# EasyEDA Pro project XQ8266.epro

# Schematic Schematic1
Create Date: 2023-09-23; Page Name: P1; Project Name: XQ8266; Schematic Name: Schematic1; Update Date: 2023-09-23; Company: 嘉立创EDA; Page Size: A4; Version: V1.0
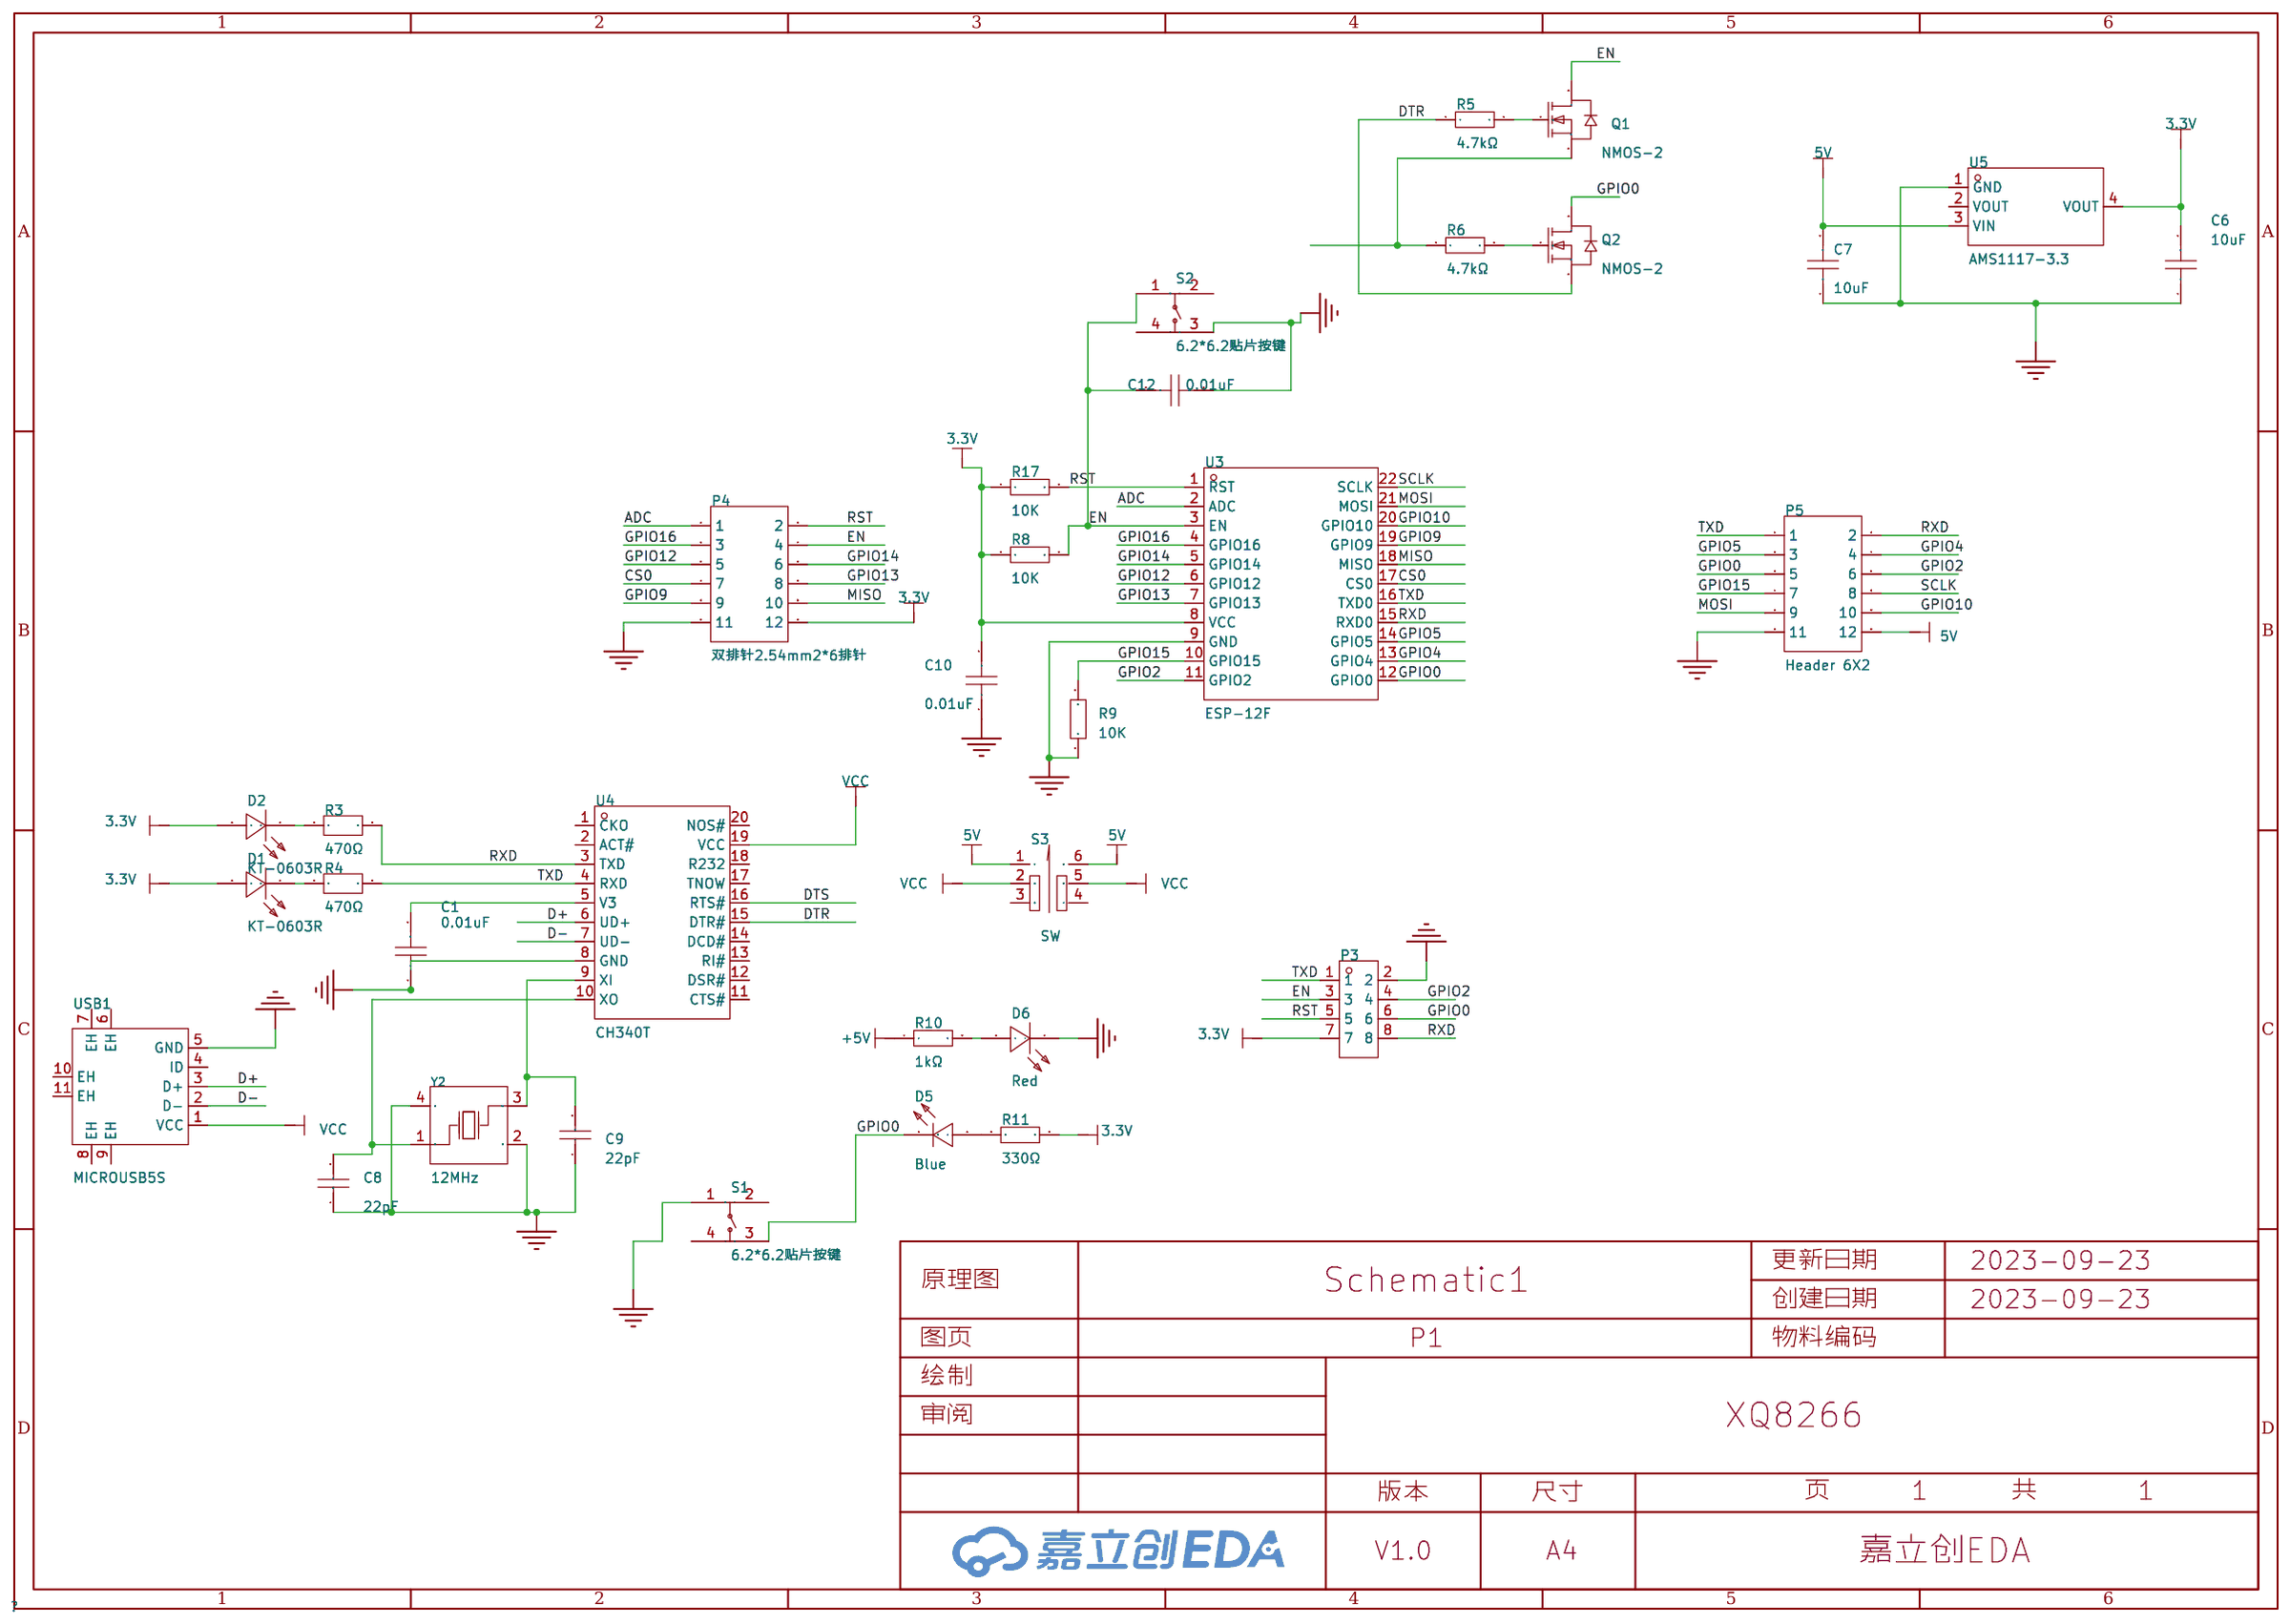
[diagram p0: schematic sheet]

## Parts
C1  0.01uF  [C0603]
C6  10uF  [C0603]
C7  10uF  [C0603]
C8  22pF  [C0603]
C9  22pF  [C0603]
C10  0.01uF  [C0603]
C12  0.01uF  [C0603]
D1  KT-0603R  [LED0603-RD]
D2  KT-0603R  [LED0603-RD]
D5  Blue  [LED0603-FD_BLUE]
D6  Red  [LED0603-RD]
P3  2.0排针 2*4p  [HDR-TH_8P-P2.54-V-M-R2-C4-S2.54_C9900007159]
P4  双排针2.54mm2*6排针  [HDR-TH_12P-P2.54-V-M-R2-C6-S2.54]
P5  Header 6X2  [HDR-TH_12P-P2.54-V-M-R2-C6-S2.54]
Q1  NMOS-2  [SOT-323-3_L2.0-W1.3-P1.30-LS2.1-BR]
Q2  NMOS-2  [SOT-323-3_L2.0-W1.3-P1.30-LS2.1-BR]
R3  470Ω  [R0603]
R4  470Ω  [R0603]
R5  4.7kΩ  [R0603]
R6  4.7kΩ  [R0603]
R8  10K  [R0603]
R9  10K  [R0603]
R10  1kΩ  [R0603]
R11  330Ω  [R0603]
R17  10K  [R0603]
S1  6.2*6.2贴片按键  [SW-SMD_4P-L6.2-W6.2-P4.00-LS9.5-TL]
S2  6.2*6.2贴片按键  [SW-SMD_4P-L6.2-W6.2-P4.00-LS9.5-TL]
S3  SW  [SW-TH_6P-L5.8-W5.8-P2.00-LS4.5-TR]
U3  ESP-12F  [WIFIM-SMD_ESP-12F-ESP8266MOD]
U4  CH340T  [SSOP-20_L7.5-W5.2-P0.65-LS8.0-BL]
U5  AMS1117-3.3  [SOT-223_L6.3-W3.5-P2.30-LS7.0-BR]
USB1  MICROUSB5S  [MICRO-USB_MICRO-USB-5S]
Y2  12MHz  [OSC-SMD_4P-L3.2-W2.5-BL]

## Library data of the parts
C1 C10 C12 = CT41-0603-2X1-50V-0.01uF-K(N): 精度:±10%;; LCSC Part Name: 10nF(103) ±10% 50V 停产; Supplier Part: C138345; Supplier Footprint: 0603; JLCPCB Part Class: 扩展库; Datasheet: https://atta.szlcsc.com/upload/public/pdf/source/20180326/C138345_833285A2150D12FF7355F029F400BCA9.pdf; Supplier: LCSC
C6 C7 = 10uF_C15415: 容值:10uF;精度:±20%;额定电压:16V;材质(温度系数):-;; LCSC Part Name: 10uF ±20% 16V; Supplier Part: C15415; Manufacturer: SAMSUNG(三星); Supplier Footprint: 0603; JLCPCB Part Class: 扩展库; Datasheet: https://atta.szlcsc.com/upload/public/pdf/source/20160103/1457707675960.pdf; Supplier: LCSC; Tolerance: ±20%; Voltage Rated: 16V
C8 C9 = CL10C220JB8NNNC: 容值:22pF;精度:±5%;额定电压:50V;材质(温度系数):C0G;; LCSC Part Name: 22pF ±5% 50V; Supplier Part: C1653; Manufacturer: SAMSUNG(三星); Supplier Footprint: 0603; JLCPCB Part Class: 基础库; Datasheet: https://atta.szlcsc.com/upload/public/pdf/source/20160103/1457707687317.pdf; Supplier: LCSC; Tolerance: ±5%; Voltage Rated: 50V; Temperature Coefficient: C0G
D1 D2 = KT-0603R: 发光颜色:红灯;二极管配置:-;透镜颜色:-;主波长:-;色温:-;功率:-;发光角度:-;安装方式:-;工作温度:-40℃~+85℃;; LCSC Part Name: 0603 红灯 高亮; Supplier Part: C2286; Manufacturer: KENTO; Supplier Footprint: 0603; JLCPCB Part Class: 基础库; Datasheet: https://atta.szlcsc.com/upload/public/pdf/source/20160616/1466072038404.pdf; Supplier: LCSC; Emitted Color: 红灯; Operating Temperature: -40℃~+85℃
D5 = 19-217/BHC-ZL1M2RY/3T: 发光颜色:蓝灯;二极管配置:-;主波长:465nm~475nm;色温:-;功率:110mW;安装方式:-;; LCSC Part Name: 蓝灯; Supplier Part: C72041; Manufacturer: EVERLIGHT(亿光); Supplier Footprint: 0603; JLCPCB Part Class: 基础库; Datasheet: https://atta.szlcsc.com/upload/public/pdf/source/20170116/1484561237273.pdf; Supplier: LCSC; Emitted Color: 蓝灯; Lens Color: 无色透明; Dominant Wavelength: 465nm~475nm; Peak Wavelength: 468nm; Forward Current: 5mA; Power Dissipation: 110mW; Viewing Angle: 120°; Operating Temperature: -40℃~+85℃
D6 = LTE-C9908-GD: Supplier Part: C9900001449; Supplier Footprint: LED0603; JLCPCB Part Class: 扩展库; Datasheet: 2021-11-05/656770A/3885ef6749d04b31ac892d11046affd6/LTE-C9908-GD.pdf; Supplier: LCSC
P3 = 2.0排针 2*4p: Supplier Part: C9900022073; Supplier Footprint: 2.0-2*4P; JLCPCB Part Class: 扩展库; Datasheet: https://atta.szlcsc.comnull; Supplier: LCSC
P4 P5 = 双排针2.54mm2*6排针: LCSC Part Name: 双排针2*6  间距2.54mm; Supplier Part: C66689; Supplier Footprint: Through Hole; JLCPCB Part Class: 扩展库; Supplier: LCSC
Q1 Q2 = NMOS-2: Supplier Part: C9900017079; JLCPCB Part Class: 扩展库; Datasheet: https://atta.szlcsc.comnull; Supplier: LCSC
R3 R4 = CR0603F470RP05Z: 阻值:470Ω;精度:±1%;功率:100mW;; LCSC Part Name: 470Ω ±1% 100mW; Supplier Part: C881392; Manufacturer: EVER OHMS(天二科技); Supplier Footprint: 0603; JLCPCB Part Class: 扩展库; Datasheet: https://atta.szlcsc.com/upload/public/pdf/source/20201014/C881429_ABC29D63C8D6A11EB63D87348B25AA7B.pdf; Supplier: LCSC; Tolerance: ±1%; Power(Watts): 100mW; Temperature Coefficient: ±100ppm/℃
R5 R6 = 0603WAF4701T5E: 电阻类型:厚膜电阻;阻值:4.7kΩ;精度:±1%;功率:100mW;; LCSC Part Name: 4.7kΩ ±1% 100mW; Supplier Part: C23162; Manufacturer: UNI-ROYAL(厚声); Supplier Footprint: 0603; JLCPCB Part Class: 基础库; Datasheet: https://atta.szlcsc.com/upload/public/pdf/source/20200306/C422600_1E6D84923E4A46A82E41ADD87F860B5C.pdf; Supplier: LCSC; Type: 厚膜电阻; Tolerance: ±1%; Power(Watts): 100mW; Temperature Coefficient: ±100ppm/℃; Overload Voltage (Max): 75V; Operating Temperature Range: -55℃~+155℃
R8 R9 R17 = 0603WAF1002T5E: 电阻类型:厚膜电阻;阻值:10kΩ;精度:±1%;功率:100mW;; LCSC Part Name: 厚膜电阻 10kΩ ±1% 100mW; Supplier Part: C25804; Manufacturer: UNI-ROYAL(厚声); Supplier Footprint: 0603; JLCPCB Part Class: 基础库; Datasheet: https://atta.szlcsc.com/upload/public/pdf/source/20200306/C422600_1E6D84923E4A46A82E41ADD87F860B5C.pdf; Supplier: LCSC; Type: 厚膜电阻; Tolerance: ±1%; Power(Watts): 100mW; Temperature Coefficient: ±100ppm/℃; Overload Voltage (Max): 75V; Operating Temperature Range: -55℃~+155℃
R10 = 0603WAF1001T5E: 电阻类型:厚膜电阻;阻值:1kΩ;精度:±1%;功率:100mW;; LCSC Part Name: 1kΩ ±1% 100mW; Supplier Part: C21190; Manufacturer: UNI-ROYAL(厚声); Supplier Footprint: 0603; JLCPCB Part Class: 基础库; Datasheet: https://atta.szlcsc.com/upload/public/pdf/source/20200306/C422600_1E6D84923E4A46A82E41ADD87F860B5C.pdf; Supplier: LCSC; Type: 厚膜电阻; Tolerance: ±1%; Power(Watts): 100mW; Temperature Coefficient: ±100ppm/℃; Overload Voltage (Max): 75V; Operating Temperature Range: -55℃~+155℃
R11 = 0805W8F3300T5E: 电阻类型:厚膜电阻;阻值:330Ω;精度:±1%;功率:125mW;; LCSC Part Name: 330Ω ±1% 125mW; Supplier Part: C17630; Manufacturer: UNI-ROYAL(厚声); Supplier Footprint: 0805; JLCPCB Part Class: 基础库; Datasheet: https://atta.szlcsc.com/upload/public/pdf/source/20200306/C422600_1E6D84923E4A46A82E41ADD87F860B5C.pdf; Supplier: LCSC; Type: 厚膜电阻; Tolerance: ±1%; Power(Watts): 125mW; Temperature Coefficient: ±100ppm/℃; Overload Voltage (Max): 150V; Operating Temperature Range: -55℃~+155℃
S1 S2 = 6.2*6.2贴片按键: Supplier Part: C9900016276; Supplier Footprint: Button_Switch_SMD:SW_Push_1P1T_NO_6x6mm_H9.5mm; JLCPCB Part Class: 扩展库; Datasheet: https://atta.szlcsc.comnull; Supplier: LCSC
S3 = 自锁开关 5.8Z白灰白260G: 耐温260度; LCSC Part Name: 自锁开关 5.8Z白灰白 260G  5.8*5.8mm; Supplier Part: C56857; Supplier Footprint: Through Hole; JLCPCB Part Class: 扩展库; Datasheet: https://atta.szlcsc.com/upload/public/pdf/source/20160318/1458266987096.pdf; Supplier: LCSC
U3 = ESP-12F(ESP8266MOD): 频率:2.4GHz;发射功率:16dBm;核心处理器:ESP8266;天线形式:PCB 板载天线;接收灵敏度:-90dBm;; LCSC Part Name: 完整的802.11b/g/n Wi-Fi的SoC模块; Supplier Part: C82891; Manufacturer: Ai-Thinker(安信可); Supplier Footprint: SMD,16x24mm; JLCPCB Part Class: 扩展库; Datasheet: https://atta.szlcsc.com/upload/public/pdf/source/20210219/C82891_ABD84A460F4F056A2757267CCCA4B508.pdf; Supplier: LCSC; Output Power: 16dBm; Core Processor: ESP8266; Support Interface: GPIO；UART；I2C；PWM；SPI；ADC; Antenna Type: PCB 板载天线; Wireless Standard: 802.11b/g/n; Operating Voltage: 3.3V; Receive  Current: 120mA; Send  Current: 170mA; Sensitivity: -90dBm; Operating Temperature: -40℃~+85℃
U4 = CH340T: 应用功能:收发器;接口协议:USB 2.0;数据速率:2Mbps;供电电压:3.3V；5V;; Supplier Part: C8689; Manufacturer: WCH(南京沁恒); Supplier Footprint: SSOP-20-208mil; JLCPCB Part Class: 扩展库; Datasheet: https://atta.szlcsc.com/upload/public/pdf/source/20200819/C8689_75D6473E5CD694BFB8B94C7CCD8C6758.pdf; Supplier: LCSC; Applications Function: 收发器; Protocol: USB 2.0; Data Rate: 2Mbps; Supply Voltage: 3.3V；5V
U5 = AMS1117-3.3_C6186: 输出类型:固定;输出极性:正;最大输入电压:-;输出电压:3.3V;输出电流:1A;电源纹波抑制比(PSRR):72dB@(120Hz);; LCSC Part Name: 输出3.3V 1A; Supplier Part: C6186; Manufacturer: AMS; Supplier Footprint: SOT-223; JLCPCB Part Class: 基础库; Datasheet: https://atta.szlcsc.com/upload/public/pdf/source/20180727/C6186_7A095716F0823C02F1997A905E26C086.pdf; Supplier: LCSC; Output Type: 固定; Output Polarity: 正; Number of Outputs: 1; Output Voltage: 3.3V; Dropout Voltage: 1.3V@(800mA); Output Current: 1A; Power Supply Rejection Ratio (PSRR): 72dB@(120Hz)
USB1 = MICROUSB5S: Supplier Part: C9900018063; Supplier Footprint: MICROUSB; JLCPCB Part Class: 扩展库; Datasheet: https://atta.szlcsc.comnull; Supplier: LCSC
Y2 = X322512MSB4SI: 频率:12MHz;频率公差:±10ppm;负载电容:20pF;; LCSC Part Name: 12MHz ±10ppm 20pF YSX321SL; Supplier Part: C9002; Manufacturer: YXC(扬兴晶振); Supplier Footprint: SMD3225-4P; JLCPCB Part Class: 基础库; Datasheet: https://atta.szlcsc.com/upload/public/pdf/source/20210329/C112971_1F611BDC486E193C1706F6D8EB5AA189.pdf; Supplier: LCSC; Crystal Type: 贴片无源晶振; Frequency Tolerance: ±10ppm; Frequency Stability: ±30ppm; Load Capacitance: 20pF; Operating Temperature: -40℃~+85℃

## Nets
3.3V: C6.2 C10.2 D1.2(A) D2.2(A) P3.7 P4.12 R8.1 R11.2 R17.1 U3.8(VCC) U5.4(VOUT)
5V: C7.2 P5.12 S3.1 S3.6 U5.3(VIN)
+5V: R10.1
GND: C1.1 C6.1 C7.1 C8.1 C9.1 C10.1 C12.1 D6.1(-) P3.2 P4.11 P5.11 R9.1 S1.1 S2.3 U3.9(GND) U4.8(GND) U5.1(GND) USB1.5(GND) Y2.2(GND) Y2.4(GND)
VCC: S3.2 S3.5 U4.19(VCC) USB1.1(VCC)
ADC: P4.1 U3.2(ADC)
CS0: P4.7 U3.17(CS0)
D+: U4.6(UD+) USB1.3(D+)
D-: U4.7(UD-) USB1.2(D-)
DTR: Q2.2(S) R5.1 U4.15(DTR#)
DTS: U4.16(RTS#)
EN: C12.2 P3.3 P4.4 Q1.3(D) R8.2 S2.1 U3.3(EN)
GPIO0: D5.1(C) P3.6 P5.5 Q2.3(D) S1.3 U3.12(GPIO0)
GPIO2: P3.4 P5.6 U3.11(GPIO2)
GPIO4: P5.4 U3.13(GPIO4)
GPIO5: P5.3 U3.14(GPIO5)
GPIO9: P4.9 U3.19(GPIO9)
GPIO10: P5.10 U3.20(GPIO10)
GPIO12: P4.5 U3.6(GPIO12)
GPIO13: P4.8 U3.7(GPIO13)
GPIO14: P4.6 U3.5(GPIO14)
GPIO15: P5.7 R9.2 U3.10(GPIO15)
GPIO16: P4.3 U3.4(GPIO16)
MISO: P4.10 U3.18(MISO)
MOSI: P5.9 U3.21(MOSI)
RST: P3.5 P4.2 R17.2 U3.1(RST)
RXD: P3.8 P5.2 R3.2 U3.15(RXD0) U4.3(TXD)
SCLK: P5.8 U3.22(SCLK)
TXD: P3.1 P5.1 R4.2 U3.16(TXD0) U4.4(RXD)
$1N964: C1.2 U4.5(V3)
$1N1564: D2.1(K) R3.1
$1N1566: D1.1(K) R4.1
$1N1958: D5.2(A) R11.1
$1N3851: Q1.1(G) R5.2
$1N3854: Q2.1(G) R6.2
$1N3868: Q1.2(S) R6.1
$1N4121: D6.2(+) R10.2
$1N4396: C8.2 U4.10(XO) Y2.1(OSC1)
$1N4419: C9.2 U4.9(XI) Y2.3(OSC2)

Not connected (* = marked no-connect by the designer): S1 2 4; S2 2 4; S3 3 4; U4 1(CKO) 2(ACT#) 11(CTS#) 12(DSR#) 13(RI#) 14(DCD#) 17(TNOW) 18(R232) 20(NOS#); U5 2(VOUT); USB1 4(ID) 6(EH) 7(EH) 8(EH) 9(EH) 10(EH) 11(EH)

# Board PCB1
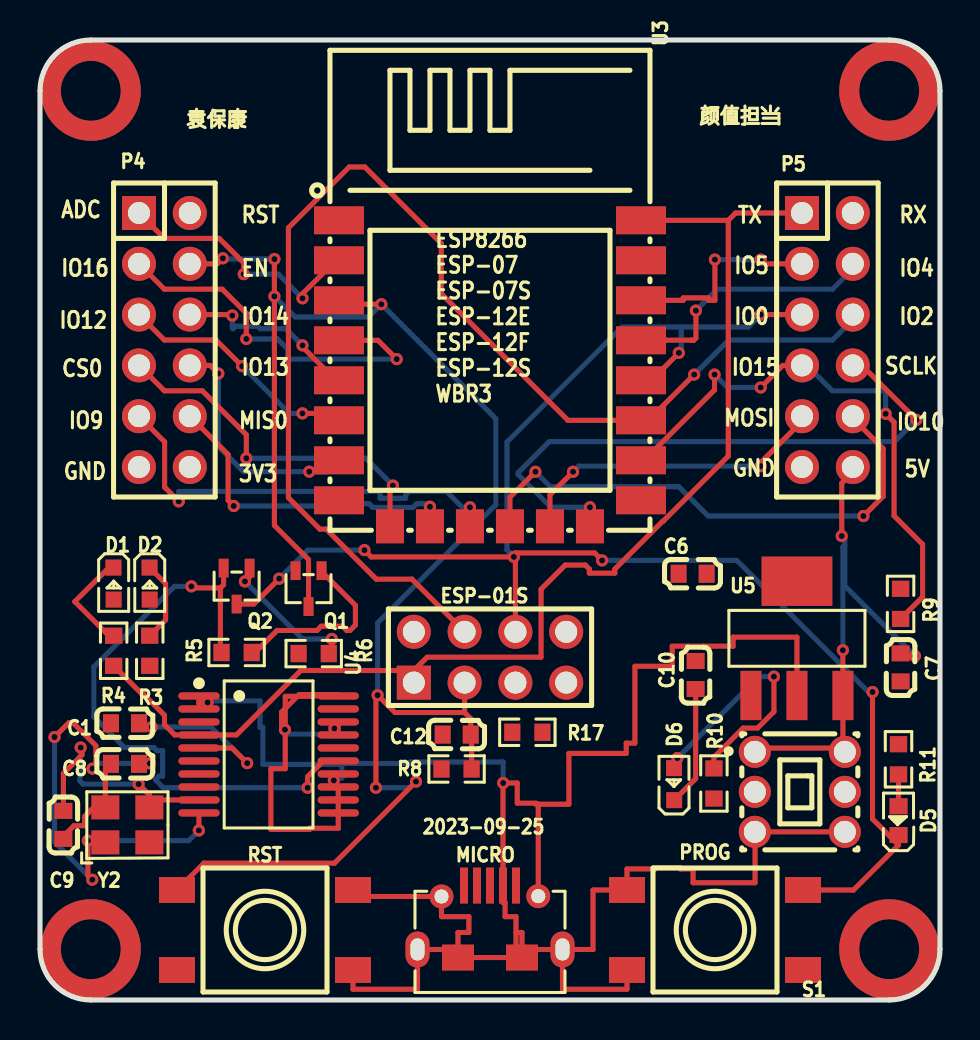
[diagram p1: board, top side]
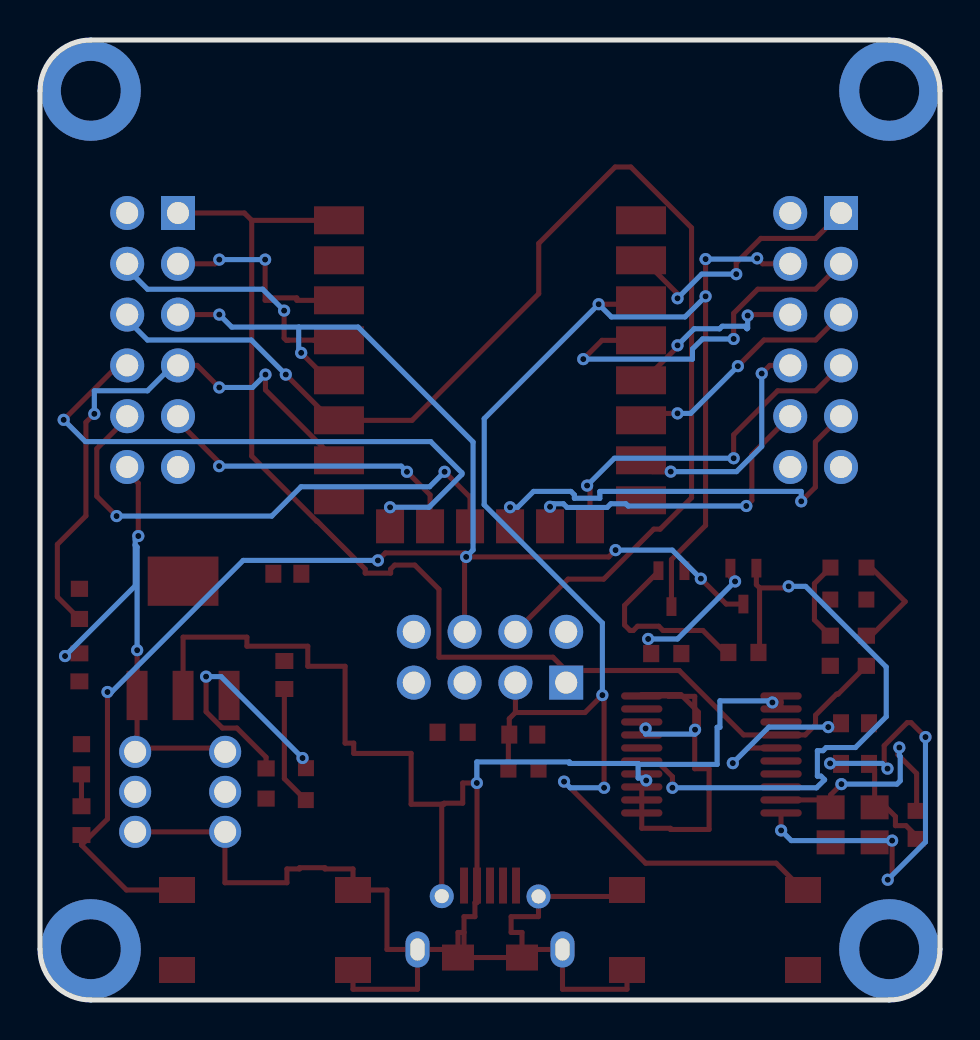
[diagram p2: board, bottom side, seen from below]

Outline 45 x 48 mm; copper layers: Top Layer, Bottom Layer. Coordinates in mm from the lower left corner of the outline.
Outline path: 0,45.46 0,2.54 arc(0.74,0.74) 2.54,0 42.46,0 arc(44.26,0.74) 45,2.54 45,45.46 arc(44.26,47.26) 42.46,48 2.54,48 arc(0.74,47.26) 0,45.46
Stack: Top Layer 0.035mm / Dielectric1 1.51mm FR4 er 4.5 / Bottom Layer 0.035mm

## Design rules (mm)
template: JLCPCB Capability(Two Layers Board)
spacing copperThickness1oz (default): track to track 0.102, other pairs 0.152 to 0.3
spacing copperThickness2oz: track to track 0.203, other pairs 0.152 to 0.3
track width copperThickness1oz (default): min 0.127, default 0.254, max 2.54
track width copperThickness2oz: min 0.203, default 0.254, max 2.54
differential pair differentialPair (default): width min 0.127, default 0.254, max 2.54; gap min 0.152, default 0.152
via viaSize (default): diameter min 0.5, default 0.61, max 10; hole min 0.3, default 0.305, max 6.3

## Placement (name value [footprint] x y rotation side)
C1  0.01uF  [C0603]  4.25 13.84 0 top
C6  10uF  [C0603]  32.63 21.31 0 top
C7  10uF  [C0603]  43.03 16.63 90 top
C8  22pF  [C0603]  4.25 11.81 0 top
C9  22pF  [C0603]  1.17 8.76 90 top
C10  0.01uF  [C0603]  32.78 16.25 90 top
C12  0.01uF  [C0603]  20.84 13.27 0 top
D1  KT-0603R  [LED0603-RD]  3.68 20.82 270 top
D2  KT-0603R  [LED0603-RD]  5.48 20.82 270 top
D5  Blue  [LED0603-FD_BLUE]  42.93 8.97 90 top
D6  Red  [LED0603-RD]  31.71 10.79 90 top
ESP-01S  2.0排针 2*4p  [HDR-TH_8P-P2.54-V-M-R2-C4-S2.54_C9900007159]  22.5 17.14 0 top
MICRO  MICROUSB5S  [MICRO-USB_MICRO-USB-5S]  22.5 3.92 180 top
P4  双排针2.54mm2*6排针  [HDR-TH_12P-P2.54-V-M-R2-C6-S2.54]  6.22 33 270 top
P5  Header 6X2  [HDR-TH_12P-P2.54-V-M-R2-C6-S2.54]  39.37 33 270 top
PROG  SW  [SW-TH_6P-L5.8-W5.8-P2.00-LS4.5-TR]  37.99 10.41 90 top
Q1  NMOS-2  [SOT-323-3_L2.0-W1.3-P1.30-LS2.1-BR]  13.43 20.57 90 top
Q2  NMOS-2  [SOT-323-3_L2.0-W1.3-P1.30-LS2.1-BR]  9.83 20.69 90 top
R3  470Ω  [R0603]  5.49 17.46 270 top
R4  470Ω  [R0603]  3.68 17.46 270 top
R5  4.7kΩ  [R0603]  9.83 17.38 0 top
R6  4.7kΩ  [R0603]  13.69 17.32 0 top
R8  10K  [R0603]  20.83 11.55 0 top
R9  10K  [R0603]  43.03 19.81 270 top
R10  1kΩ  [R0603]  33.7 10.82 90 top
R11  330Ω  [R0603]  42.93 12.04 90 top
R17  10K  [R0603]  24.37 13.39 0 top
RST  6.2*6.2贴片按键  [SW-SMD_4P-L6.2-W6.2-P4.00-LS9.5-TL]  11.25 3.5 0 top
S1  6.2*6.2贴片按键  [SW-SMD_4P-L6.2-W6.2-P4.00-LS9.5-TL]  33.75 3.5 180 top
U3  ESP-12F  [WIFIM-SMD_ESP-12F-ESP8266MOD]  22.5 31.33 270 top
U4  CH340T  [SSOP-20_L7.5-W5.2-P0.65-LS8.0-BL]  11.43 12.28 270 top
U5  AMS1117-3.3  [SOT-223_L6.3-W3.5-P2.30-LS7.0-BR]  37.85 18.08 270 top
Y2  12MHz  [OSC-SMD_4P-L3.2-W2.5-BL]  4.37 8.76 0 top

## Footprints (pads in the part's own frame, mm; a bottom-side part is the same pattern mirrored in y, then rotated)
C0603
  rect 0.8x0.9 smd: 1(-0.7,0) 2(0.7,0)
HDR-TH_8P-P2.54-V-M-R2-C4-S2.54_C9900007159
  rect 1.7x1.7 hole 1.1: 1(-3.81,-1.27)
  round 1.7 hole 1.1: 2(-3.81,1.27) 3(-1.27,-1.27) 4(-1.27,1.27) 5(1.27,-1.27) 6(1.27,1.27) 7(3.81,-1.27) 8(3.81,1.27)
HDR-TH_12P-P2.54-V-M-R2-C6-S2.54
  rect 1.7x1.7 hole 1.1: 1(-6.35,-1.27)
  round 1.7 hole 1.1: 2(-6.35,1.27) 3(-3.81,-1.27) 4(-3.81,1.27) 5(-1.27,-1.27) 6(-1.27,1.27) 7(1.27,-1.27) 8(1.27,1.27) 9(3.81,-1.27) 10(3.81,1.27) 11(6.35,-1.27) 12(6.35,1.27)
LED0603-FD_BLUE
  rect 0.8x0.9 smd: 1(-0.72,0) 2(0.72,0)
LED0603-RD
  rect 0.8x0.8 smd: 1(-0.799,-0.004) 2(0.799,0.004)
MICRO-USB_MICRO-USB-5S
  rect 0.4x1.8 smd: 1(1.3,-1.8) 2(0.65,-1.8) 3(0.001,-1.8) 4(-0.649,-1.8) 5(-1.3,-1.8)
  round 1.2 hole 0.7: 6(-2.413,-1.27) 9(2.425,-1.254)
  oval 1.2x1.8 hole 0.7x1.1: 7(-3.625,1.396) 8(3.625,1.396)
  rect 1.6x1.3 smd: 10(-1.6,1.8) 11(1.6,1.8)
OSC-SMD_4P-L3.2-W2.5-BL
  rect 1.4x1.2 smd: 1(-1.1,-0.875) 2(1.1,-0.875) 3(1.1,0.875) 4(-1.1,0.875)
R0603
  rect 0.806x0.864 smd: 1(-0.753,0) 2(0.753,0)
SOT-223_L6.3-W3.5-P2.30-LS7.0-BR
  rect 2.465x1.05 smd: 1(2.857,-2.3) 2(2.857,0) 3(2.857,2.3)
  rect 2.465x3.54 smd: 4(-2.857,0)
SOT-323-3_L2.0-W1.3-P1.30-LS2.1-BR
  rect 0.936x0.5 smd: 1(0.898,-0.65) 2(0.898,0.65) 3(-0.898,0)
SSOP-20_L7.5-W5.2-P0.65-LS8.0-BL
  oval 0.364x2.069 smd: 1(-2.925,-3.482) 2(-2.275,-3.482) 3(-1.625,-3.482) 4(-0.975,-3.482) 5(-0.325,-3.482) 6(0.325,-3.482) 7(0.975,-3.482) 8(1.625,-3.482) 9(2.275,-3.482) 10(2.925,-3.482) 11(2.925,3.482) 12(2.275,3.482) 13(1.625,3.482) 14(0.975,3.482) 15(0.325,3.482) 16(-0.325,3.482) 17(-0.975,3.482) 18(-1.625,3.482) 19(-2.275,3.482) 20(-2.925,3.482)
SW-SMD_4P-L6.2-W6.2-P4.00-LS9.5-TL
  rect 1.8x1.3 smd: 1(-4.4,2) 2(4.4,2) 3(-4.4,-2) 4(4.4,-2)
SW-TH_6P-L5.8-W5.8-P2.00-LS4.5-TR
  round 1.6 hole 1.1: 1(2,2.25) 2(0,2.25) 3(-2,2.25) 4(-2,-2.25) 5(0,-2.25) 6(2,-2.25)
WIFIM-SMD_ESP-12F-ESP8266MOD
  rect 1.4x2.5 smd: 1(-7.651,-7.551) 2(-5.651,-7.551) 3(-3.651,-7.551) 4(-1.651,-7.551) 5(0.349,-7.551) 6(2.349,-7.551) 7(4.349,-7.551) 8(6.349,-7.551) 9(6.349,7.548) 10(4.349,7.55) 11(2.349,7.551) 12(0.349,7.551) 13(-1.651,7.55) 14(-3.651,7.551) 15(-5.651,7.551) 16(-7.651,7.551)
  rect 1.7x1.4 smd: 17(7.651,-5) 18(7.649,-3.002) 19(7.649,-1.004) 20(7.649,0.998) 21(7.649,2.997) 22(7.651,4.997)

## Nets
3.3V: C6.2 C10.2 D1.2 D2.2 ESP-01S.7 P4.12 R8.1 R11.2 R17.1 U3.8 U5.4
5V: C7.2 P5.12 PROG.1 PROG.6 U5.3
+5V: R10.1
GND: C1.1 C6.1 C7.1 C8.1 C9.1 C10.1 C12.1 D6.1 ESP-01S.2 MICRO.5 P4.11 P5.11 R9.1 RST.3 S1.1 U3.9 U4.8 U5.1 Y2.2 Y2.4
VCC: MICRO.1 PROG.2 PROG.5 U4.19
ADC: P4.1 U3.2
CS0: P4.7 U3.17
D+: MICRO.3 U4.6
D-: MICRO.2 U4.7
DTR: Q2.2 R5.1 U4.15
DTS: U4.16
EN: C12.2 ESP-01S.3 P4.4 Q1.3 R8.2 RST.1 U3.3
GPIO0: D5.1 ESP-01S.6 P5.5 Q2.3 S1.3 U3.12
GPIO2: ESP-01S.4 P5.6 U3.11
GPIO4: P5.4 U3.13
GPIO5: P5.3 U3.14
GPIO9: P4.9 U3.19
GPIO10: P5.10 U3.20
GPIO12: P4.5 U3.6
GPIO13: P4.8 U3.7
GPIO14: P4.6 U3.5
GPIO15: P5.7 R9.2 U3.10
GPIO16: P4.3 U3.4
MISO: P4.10 U3.18
MOSI: P5.9 U3.21
RST: ESP-01S.5 P4.2 R17.2 U3.1
RXD: ESP-01S.8 P5.2 R3.2 U3.15 U4.3
SCLK: P5.8 U3.22
TXD: ESP-01S.1 P5.1 R4.2 U3.16 U4.4
$1N964: C1.2 U4.5
$1N1564: D2.1 R3.1
$1N1566: D1.1 R4.1
$1N1958: D5.2 R11.1
$1N3851: Q1.1 R5.2
$1N3854: Q2.1 R6.2
$1N3868: Q1.2 R6.1
$1N4121: D6.2 R10.2
$1N4396: C8.2 U4.10 Y2.1
$1N4419: C9.2 U4.9 Y2.3

Pads without a net: MICRO 4 6 7 8 9 10 11; PROG 3 4; RST 2 4; S1 2 4; U4 1 2 11 12 13 14 17 18 20; U5 2

## Via types
v1: diameter 0.61, hole 0.305, Top Layer to Bottom Layer, 67 vias
v2: diameter 5, hole 3, Top Layer to Bottom Layer, 4 vias

## Routing (per net, layer and track width the routed paths; a pad name or vN(x,y) marks a point on that pad's centre or on a via; arc(x,y) is an arc through that point)
5V: length 27
  Top Layer w0.254: 40.15,12.6 35.93,12.6 PROG.1 ; 40.15,12.6 40.24,12.5 PROG.6 ; 40.15,12.6 U5.3 40.14,15.23 v1(40.14,17.49) ; v1(40.09,23.2) 40.09,25.84 40.89,26.65 ; v1(43.75,17.2) 43.17,17.2 C7.2
  Bottom Layer w0.254: 40.24,22.75 40.24,20.7 v1(43.75,17.2) ; 40.24,22.75 40.14,22.65 v1(40.14,17.49) ; 40.24,22.75 40.24,23.04 v1(40.09,23.2)
GND: length 11.4
  Top Layer w0.254: 31.71,9.99 32.78,11.07 C10.1 ; C8.1 3.27,11.52 Y2.4 2.69,9.63 2.23,9.17 2.23,8.72 1.7,8.72 1.17,8.19 C9.1
(no net): length 139.7
  Top Layer w0.254: 24.91,9.79 24.8,9.79 24.8,9.84 23.86,9.84 23.86,10.85 v1(23.16,10.85) 23.15,10.85 MICRO.4 23.15,4.87 23.25,4.87 23.25,4.17 23.8,4.17 23.8,3.38 ; 24.91,9.79 MICRO.6 ; 24.91,9.79 26.44,9.79 26.44,12.33 29.31,12.33 29.31,12.84 29.75,12.84 29.75,16.69 31.61,16.69 31.61,17.69 34.65,17.69 34.65,18.14 37.85,18.14 U5.2 ; 12.87,15.18 12.96,15.27 14.91,15.27 U4.20 13.56,15.2 13.56,15.18 12.87,15.18 ; 12.87,15.18 12.26,14.58 ; 12.87,15.18 12.26,15.18 12.26,14.58 ; v1(12.25,13.52) 12.08,13.52 12.08,14.39 12.26,14.58 ; S1.2 29.35,0.54 26.12,0.54 MICRO.7 ; 35.75,8.41 35.75,5.86 32.65,5.86 32.65,6.55 32.02,6.55 32.02,6.61 30.75,6.61 30.75,6.55 29.35,6.55 S1.4 27.65,5.5 27.65,2.53 MICRO.7 ; 35.75,8.41 PROG.4 ; 35.75,8.41 PROG.3 ; 24.1,2.53 24.1,3.38 23.8,3.38 ; 24.1,2.53 MICRO.10 ; 24.1,2.53 MICRO.7 ; U4.17 U4.18 14.72,13.9 v1(14.72,13.58) ; 20.9,2.53 20.9,3.38 21.44,3.38 21.44,4.17 20.07,4.17 MICRO.9 15.65,5.18 RST.2 ; 20.9,2.53 MICRO.11 23.8,2.12 23.8,3.38 ; 20.9,2.53 MICRO.8 18.88,0.54 15.65,0.54 RST.4 ; 7.95,14.88 v1(8.38,14.88) ; 7.95,14.88 U4.2 ; 7.95,14.88 U4.1 ; U4.14 14.69,11.3 v1(14.69,10.98) 14.69,10.65 U4.13 U4.12 U4.11 14.91,8.59 13.48,8.59 13.48,8.53 11.54,8.53 11.54,11.56 12.26,11.56 12.26,14.58
  Bottom Layer w0.254: 15.09,11.78 15.09,11.1 14.69,11.1 v1(14.69,10.98) ; 15.09,11.78 15.09,11.83 18.53,11.83 18.53,11.9 23.16,11.9 v1(23.16,10.85) ; 15.09,11.78 11.14,11.78 11.14,13.64 11,13.64 11,14.96 8.38,14.96 v1(8.38,14.88) ; v1(14.72,13.58) 14.72,13.29 12.25,13.29 v1(12.25,13.52)
  vias: v2(2.54,45.46) v2(2.54,2.54) v2(42.46,45.46) v2(42.46,2.54)
ADC: length 13
  Top Layer w0.254: v1(13.12,35.08) 13.12,35.31 14.79,36.98 U3.2 ; P4.1 6.22,38.08 8.96,38.08 10.19,36.85 v1(10.19,36.29)
  Bottom Layer w0.254: v1(10.19,36.29) 11.92,36.29 v1(13.12,35.08)
CS0: length 18
  Top Layer w0.254: v1(17.65,25.72) 17.5,25.58 U3.17 ; v1(10.32,27.09) 10.32,28.26 8.12,30.46 6.22,30.46 P4.7
  Bottom Layer w0.254: v1(10.32,27.09) 16.28,27.09 v1(17.65,25.72)
DTR: length 30.9
  Top Layer w0.254: 9.02,20.6 7.65,20.6 v1(7.57,20.68) ; 9.02,20.6 9.18,20.76 Q2.2 ; 9.02,20.6 9.02,17.43 9.08,17.38 ; v1(13.38,10.61) 13.38,11.17 14.17,11.95 U4.15
  Bottom Layer w0.254: v1(13.38,10.61) 6.17,10.61 5.77,11.01 5.95,11.19 6.13,11.19 6.13,12.47 5.85,12.47 5.69,12.62 4.23,12.62 2.69,14.16 2.69,16.65 6.72,20.68 v1(7.57,20.68)
EN: length 85.2
  Top Layer w0.254: R8.2 21.58,13.22 C12.2 21.54,14.07 21.23,14.37 ; v1(16.8,10.61) 16.8,15.16 v1(16.88,15.24) 17.75,14.37 21.23,14.37 ; 21.23,14.37 ESP-01S.3 ; v1(17.07,34.79) 15.14,34.79 U3.3 ; v1(9.14,37.08) 8.87,36.81 P4.4 ; v1(18.8,10.92) 14.72,6.84 8.19,6.84 RST.1 ; v1(11.72,37.05) v1(11.72,35.18) 11.72,23.73 13.43,22.02 Q1.3
  Bottom Layer w0.254: v1(16.8,10.61) 18.49,10.61 v1(18.8,10.92) ; v1(16.88,15.24) 16.88,18.85 22.79,24.76 22.79,29.07 v1(17.07,34.79) 16.43,34.15 12.75,34.15 v1(11.72,35.18) ; v1(9.14,37.08) 9.18,37.05 v1(11.72,37.05)
GPIO0: length 81.8
  Top Layer w0.254: 23.77,22.35 27.73,22.35 v1(28.1,21.98) ; 23.77,22.35 23.69,22.27 v1(23.69,22.15) 16.56,22.15 v1(16.22,22.49) ; 23.77,22.35 ESP-01S.6 ; 42.93,7.75 40.68,5.5 S1.3 ; 42.93,7.75 41.63,9.05 v1(41.63,15.4) ; 42.93,7.75 D5.1 ; v1(11.96,21.07) 10.69,19.8 Q2.3 ; v1(31.94,32.36) 30.57,30.98 U3.12 ; v1(36.04,34.27) 38.35,34.27
  Bottom Layer w0.254: v1(41.63,15.4) 41.42,15.4 34.84,21.98 v1(28.1,21.98) ; 32.06,33.65 29.09,33.65 23.35,27.9 23.35,22.5 v1(23.69,22.15) ; 32.06,33.65 32.06,32.48 v1(31.94,32.36) ; 32.06,33.65 35.41,33.65 v1(36.04,34.27) ; v1(16.22,22.49) 13.39,22.49 v1(11.96,21.07)
GPIO2: length 63.7
  Top Layer w0.254: v1(32.71,31.27) 30.42,28.98 U3.11 26.4,28.98 20.06,35.32 20.06,37.83 16.24,41.65 15.46,41.65 12.42,38.61 12.42,25.11 13.99,23.54 14.31,23.54 16.81,21.04 18.6,21.04 ESP-01S.4
  Bottom Layer w0.254: v1(32.71,31.27) 34.44,33 39.62,33 40.89,34.27
GPIO4: length 13.2
  Top Layer w0.254: U3.13 31.3,32.98 31.31,32.99 32.57,32.99 32.58,32.98 32.69,32.98 32.79,33.09 v1(32.79,34.47)
  Bottom Layer w0.254: 40.89,36.81 39.62,35.54 33.87,35.54 v1(32.79,34.47)
GPIO5: length 10.7
  Top Layer w0.254: 38.35,36.81 36.25,36.81 v1(36.04,37.02) ; U3.14 32.16,34.98 32.16,35.11 33.43,35.11 33.43,34.98 33.74,34.98 v1(33.74,37.02)
  Bottom Layer w0.254: v1(33.74,37.02) v1(36.04,37.02)
GPIO9: length 22
  Top Layer w0.254: U3.19 21.5,24.64 ; v1(6.94,24.93) 6.23,25.64 6.23,27.91 P4.9
  Bottom Layer w0.254: v1(6.94,24.93) 6.94,25.43 17.01,25.43 17.01,25.09 18.28,25.09 18.28,25.26 18.45,25.43 20.32,25.43 21.12,24.64 v1(21.5,24.64)
GPIO10: length 26.5
  Top Layer w0.254: v1(41.17,24.2) 42.16,25.19 42.16,27.56 40.89,28.83 40.89,29.19 ; U3.20 23.5,25.14 v1(24.77,26.41)
  Bottom Layer w0.254: v1(41.17,24.2) 33.41,24.2 31.95,25.66 25.52,25.66 v1(24.77,26.41)
GPIO12: length 12.2
  Top Layer w0.254: v1(10.11,31.69) 8.8,33 6.22,33 P4.5 ; U3.6 14.6,29.33 v1(13.12,29.33)
  Bottom Layer w0.254: v1(13.12,29.33) 12.47,29.33 v1(10.11,31.69)
GPIO13: length 12
  Top Layer w0.254: v1(8.91,31.32) 8.51,31.73 P4.8 ; v1(13.46,26.42) 14.38,26.42 U3.7
  Bottom Layer w0.254: v1(8.91,31.32) 8.91,27.68 10.17,26.42 v1(13.46,26.42)
GPIO14: length 9.4
  Top Layer w0.254: P4.6 9.57,34.27 v1(9.62,34.22) ; v1(13.12,32.73) 13.12,32.66 14.79,30.98 U3.5
  Bottom Layer w0.254: v1(9.62,34.22) 9.62,33.59 9.65,33.56 9.68,33.59 9.68,33.62 9.74,33.69 10.89,33.69 11.02,33.56 12.29,33.56 v1(13.12,32.73)
GPIO15: length 28.3
  Top Layer w0.254: v1(42.28,29.31) 42.7,28.89 42.7,24.21 44.13,22.78 44.13,20.16 R9.2 ; 38.35,31.73 37.14,31.73 v1(36.04,30.63) ; U3.10 30.21,26.98 33.73,30.51 v1(33.73,31.27)
  Bottom Layer w0.254: v1(33.73,31.27) 34.37,30.63 v1(36.04,30.63) ; v1(42.28,29.31) 42.28,30.46 39.62,30.46 38.35,31.73
GPIO16: length 19.2
  Top Layer w0.254: P4.3 6.22,35.54 9.11,35.54 10.32,34.33 v1(10.32,33.05) ; U3.4 16.9,32.98 v1(17.84,32.04)
  Bottom Layer w0.254: v1(10.32,33.05) 11.87,33.05 12.38,32.55 12.38,32.04 v1(17.84,32.04)
MISO: length 16.5
  Top Layer w0.254: P4.10 9.41,27.27 9.41,24.98 v1(9.69,24.7) ; U3.18 v1(19.5,24.66)
  Bottom Layer w0.254: v1(9.69,24.7) 15.6,24.7 15.71,24.81 16.46,24.81 16.64,24.63 18.65,24.63 18.83,24.81 19.35,24.81 v1(19.5,24.66)
MOSI: length 16.2
  Top Layer w0.254: v1(36.04,26.69) 36.04,26.88 38.35,29.19 ; v1(26.65,26.41) 25.5,25.26 U3.21
  Bottom Layer w0.254: v1(36.04,26.69) 26.93,26.69 v1(26.65,26.41)
SCLK: length 30.4
  Top Layer w0.254: U3.22 v1(27.5,24.64) ; 40.89,31.73 41.09,31.73 v1(43.82,29.01)
  Bottom Layer w0.254: v1(43.82,29.01) 42.73,27.92 25.47,27.92 23.9,26.36 23.9,26.28 25.55,24.64 v1(27.5,24.64)
TXD: length 61.6
  Top Layer w0.254: 34.41,38.98 34.41,27.2 31.16,23.94 31.14,23.94 28.74,21.54 28.74,21.34 27.47,21.34 27.47,21.54 27.27,21.75 26.26,21.75 25.05,20.54 25.05,17.14 19.35,17.14 18.69,16.47 ; 34.41,38.98 U3.16 ; 34.41,38.98 34.78,39.35 38.35,39.35 ; 18.69,16.47 13.04,16.47 9.82,13.25 U4.4 6.74,13.25 6.22,13.77 6.22,14.24 5.17,15.3 5.1,15.3 R4.2 ; 18.69,16.47 ESP-01S.1
$1N964: length 9
  Top Layer w0.254: U4.5 9.6,12.6 v1(10.36,11.84) ; v1(5.59,13.64) 5.14,13.64 C1.2
  Bottom Layer w0.254: v1(10.36,11.84) 8.56,13.64 v1(5.59,13.64)
$1N1564: length 4.1
  Top Layer w0.254: R3.1 6.28,19.01 6.28,20.82 D2.1
$1N1566: length 5.3
  Top Layer w0.254: R4.1 3.44,18.22 1.74,19.92 3.44,21.62 D1.1
$1N1958: length 1.6
  Top Layer w0.254: D5.2 42.93,11.28
$1N3851: length 9.3
  Top Layer w0.254: Q1.1 14.08,21.42 15.77,19.73 15.77,18.75 15.5,18.48 15.33,18.48 15.12,18.69 14.06,18.69 13.85,18.48 11.86,18.48 10.75,17.38 R5.2
$1N3854: length 7.1
  Top Layer w0.254: v1(14.59,18.05) 14.59,17.47 R6.2 ; Q2.1 10.48,21.16 v1(10.25,20.93)
  Bottom Layer w0.254: v1(10.25,20.93) 13.12,18.05 v1(14.59,18.05)
$1N4121: length 13.3
  Top Layer w0.254: v1(31.87,12.1) 31.87,11.76 D6.2 ; v1(36.7,16.17) 36.7,14.41 35.88,13.6 35.16,13.6 33.7,12.14 R10.2
  Bottom Layer w0.254: v1(31.87,12.1) 35.94,16.17 v1(36.7,16.17)
$1N4396: length 25.1
  Top Layer w0.254: v1(2.61,6.01) 2.39,6.23 v1(2.39,7.97) 3.18,7.97 Y2.1 ; v1(7.94,8.48) 7.95,8.48 U4.10 ; C8.2 5.47,11.81 v1(5.5,11.83) ; v1(0.73,13.15) 1.44,13.87 1.64,13.87 2.79,12.72 2.79,11.73 v1(2.62,11.57)
  Bottom Layer w0.254: v1(5.5,11.83) 2.89,11.83 v1(2.62,11.57) ; v1(7.94,8.48) 7.43,7.97 v1(2.39,7.97) ; v1(2.61,6.01) 0.73,7.9 v1(0.73,13.15)
$1N4419: length 12.1
  Top Layer w0.254: v1(2.03,12.62) 2.1,12.56 2.1,12.26 1.17,11.33 1.17,9.46 ; U4.9 5.47,10 ; 5.47,10 Y2.3 ; 5.47,10 5.47,10.25 v1(4.93,10.79)
  Bottom Layer w0.254: v1(2.03,12.62) 2.03,12.23 1.99,12.18 1.99,10.95 2.15,10.79 v1(4.93,10.79)

## Text on the board
Top Silkscreen Layer: 2023-09-25 | ESP8266 / ESP-07 / ESP-07S / ESP-12E / ESP-12F / ESP-12S / WBR3 | IO12 | ADC | IO16 | CS0 | GND | IO9 | 3V3 | MIS0 | RST | EN | IO14 | IO13 | MOSI | IO15 | IO5 | IO0 | TX | SCLK | IO10 | RX | IO4 | IO2 | 5V | 袁保康 | 颜值担当
